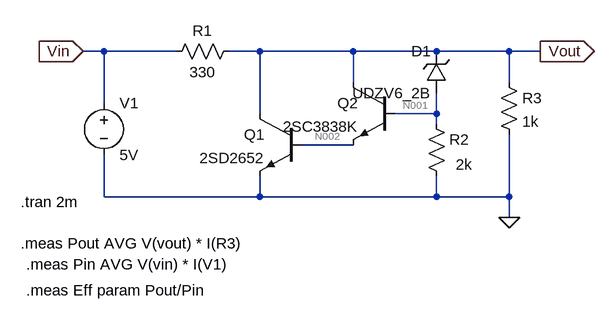
[diagram p0: schematic bai1.asc]
bai1.asc, the LTspice schematic file:
Version 4
SHEET 1 880 680
WIRE -336 16 -368 16
WIRE -224 16 -336 16
WIRE -96 16 -144 16
WIRE 48 16 -96 16
WIRE 176 16 48 16
WIRE 288 16 176 16
WIRE 336 16 288 16
WIRE 48 64 48 16
WIRE 288 64 288 16
WIRE -336 96 -336 16
WIRE -96 112 -96 16
WIRE 176 112 176 80
WIRE 176 112 112 112
WIRE 176 128 176 112
WIRE 48 160 -32 160
WIRE -336 240 -336 176
WIRE -96 240 -96 208
WIRE -96 240 -336 240
WIRE 176 240 176 208
WIRE 176 240 -96 240
WIRE 288 240 288 144
WIRE 288 240 176 240
WIRE 288 272 288 240
FLAG -368 16 Vin
IOPIN -368 16 In
FLAG 336 16 Vout
IOPIN 336 16 Out
FLAG 288 272 0
SYMBOL res -128 0 R90
WINDOW 0 0 56 VBottom 2
WINDOW 3 32 56 VTop 2
SYMATTR InstName R1
SYMATTR Value 330
SYMBOL res 160 112 R0
WINDOW 3 46 78 Left 2
SYMATTR Value 2k
SYMATTR InstName R2
SYMBOL res 272 48 R0
SYMATTR InstName R3
SYMATTR Value 1k
SYMBOL npn3 -32 112 M0
SYMATTR InstName Q1
SYMATTR Value 2SD2652
SYMBOL npn3 112 64 M0
SYMATTR InstName Q2
SYMATTR Value 2SC3838K
SYMBOL zener 192 80 R180
WINDOW 0 24 64 Left 2
WINDOW 3 24 0 Left 2
SYMATTR InstName D1
SYMATTR Value UDZV6_2B
SYMBOL voltage -336 80 R0
WINDOW 123 0 0 Left 0
WINDOW 39 0 0 Left 0
SYMATTR InstName V1
SYMATTR Value 5V
TEXT -464 248 Left 2 !.tran 2m
TEXT -464 312 Left 2 !.meas Pout AVG V(vout) * I(R3)
TEXT -456 344 Left 2 !.meas Pin AVG V(vin) * I(V1)
TEXT -456 384 Left 2 !.meas Eff param Pout/Pin

The netlist it stands for:
* bai1.asc
R1 Vout Vin 330
R2 N001 0 2k
R3 Vout 0 1k
Q1 Vout N002 0 0 2SD2652
Q2 Vout N001 N002 0 2SC3838K
D1 N001 Vout UDZV6_2B
V1 Vin 0 5V
.model D D
.lib standard.dio
.model NPN NPN
.model PNP PNP
.lib standard.bjt
.tran 2m
.meas Pout AVG V(vout) * I(R3)
.meas Pin AVG V(vin) * I(V1)
.meas Eff param Pout/Pin
.backanno
.end

* Results of the author's LTspice run, read from the files saved beside the schematic
* Operating Point, zero values left out:
*   V(vout) = 3.759 V
*   V(vin) = 5 V
*   V(n001) = 467.6 nV
*   V(n002) = 143 mV
*   Ic(Q1) = 60.45 pA
*   Ie(Q1) = -60.15 pA
*   Ic(Q2) = 3.785 pA
*   Ib(Q2) = -4.089 pA
*   I(D1) = -229.7 pA
*   I(R1) = -3.759 mA
*   I(R2) = 233.8 pA
*   I(R3) = 3.759 mA
*   I(V1) = -3.759 mA
* From the log:
*   pout: AVG(v(vout))=3.7594 FROM 0 TO 0.002
*   pin: AVG(v(vin))=5 FROM 0 TO 0.002
*   eff: pout/pin=0.75188